# EAGLE design dj midi controller (EAGLE 9.4.0)
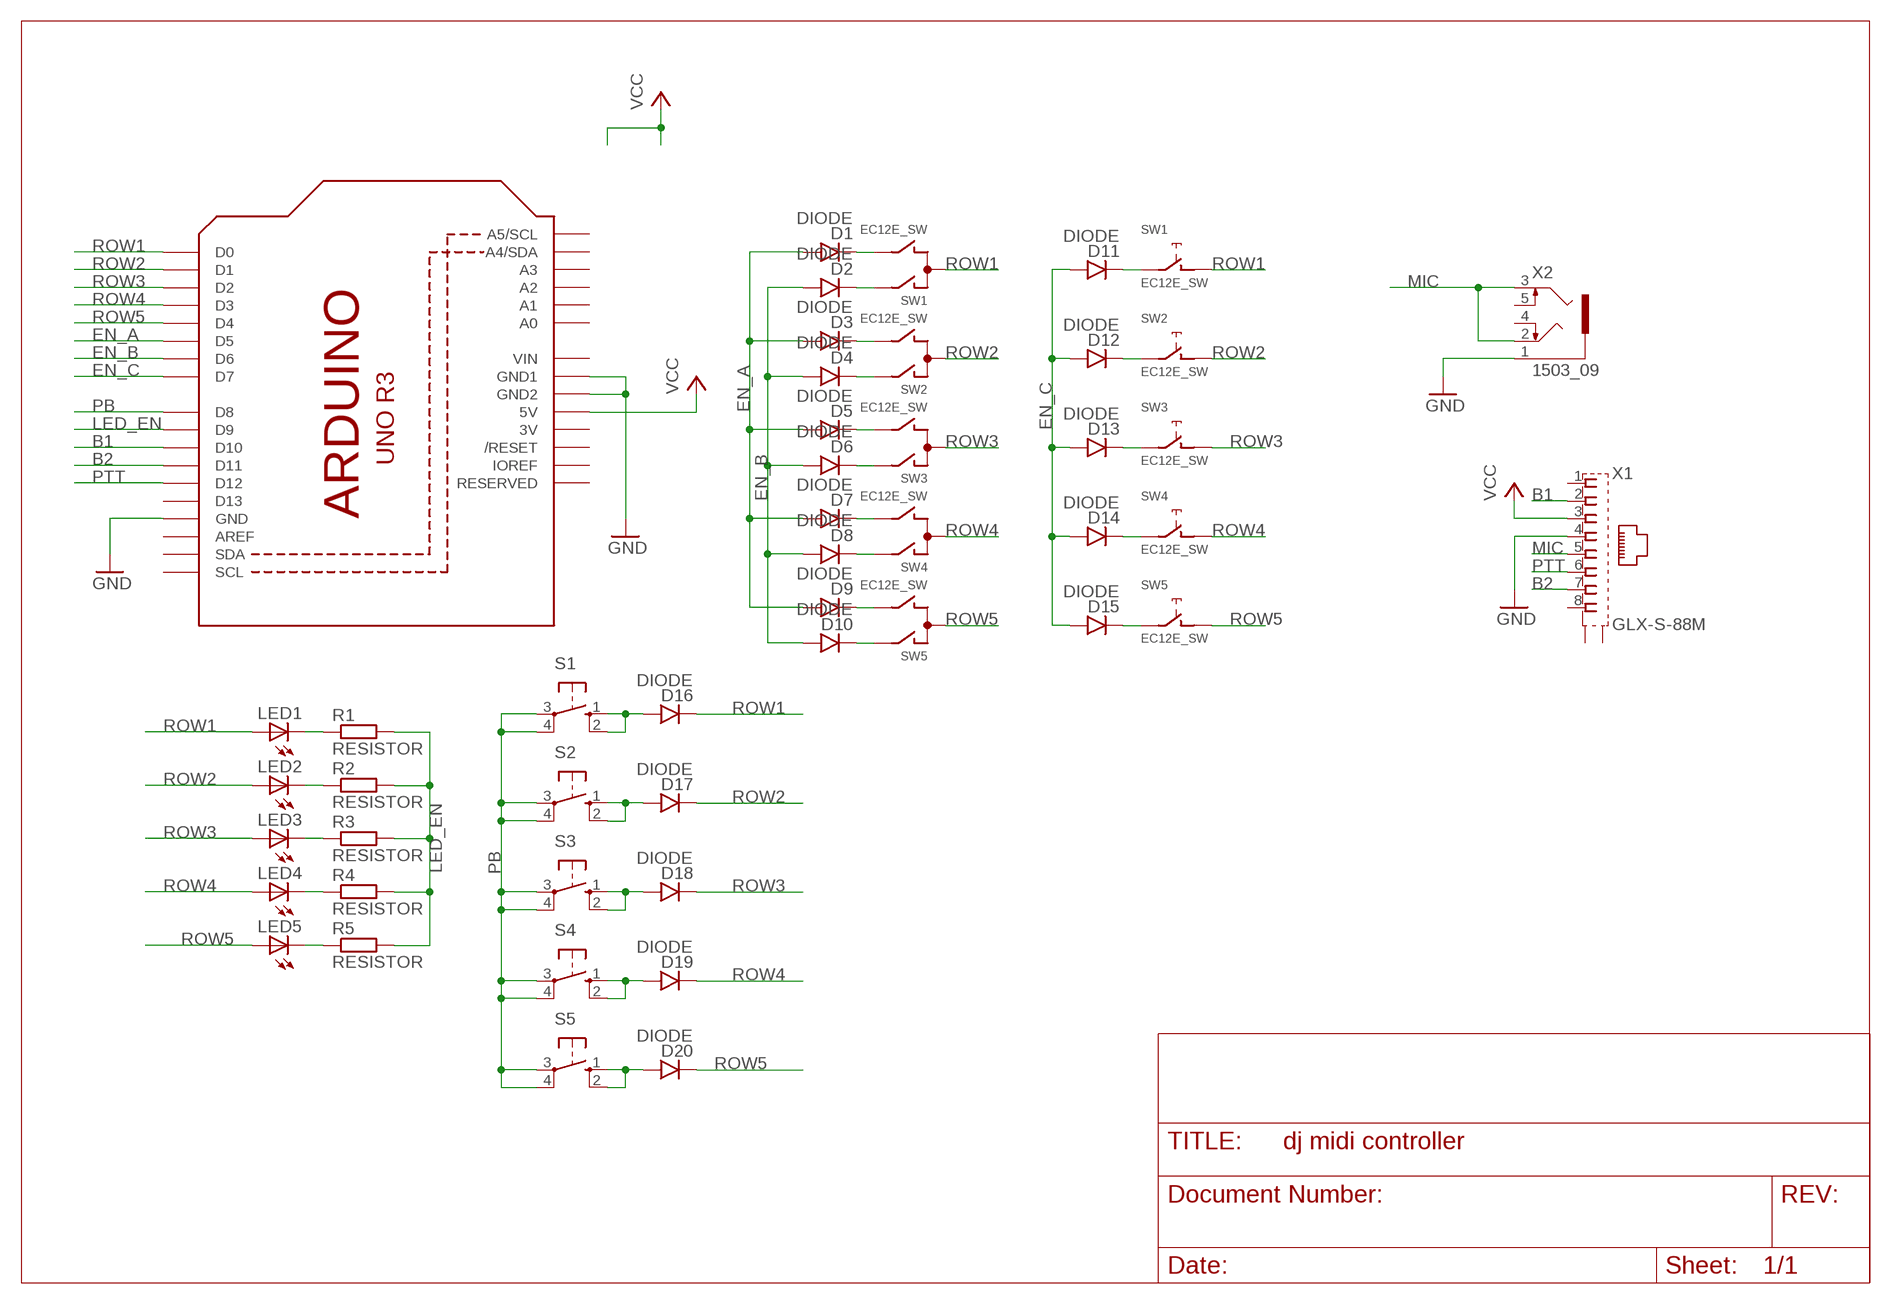
[diagram p0: schematic, sheet 1]

## Parts
D1  DIODE  [M0805]
D2  DIODE  [M0805]
D3  DIODE  [M0805]
D4  DIODE  [M0805]
D5  DIODE  [M0805]
D6  DIODE  [M0805]
D7  DIODE  [M0805]
D8  DIODE  [M0805]
D9  DIODE  [M0805]
D10  DIODE  [M0805]
D11  DIODE  [M0805]
D12  DIODE  [M0805]
D13  DIODE  [M0805]
D14  DIODE  [M0805]
D15  DIODE  [M0805]
D16  DIODE  [M0805]
D17  DIODE  [M0805]
D18  DIODE  [M0805]
D19  DIODE  [M0805]
D20  DIODE  [M0805]
LED1  LED3MM  [LED3MM]
LED2  LED3MM  [LED3MM]
LED3  LED3MM  [LED3MM]
LED4  LED3MM  [LED3MM]
LED5  LED3MM  [LED3MM]
R1  RESISTOR  [M0805]
R2  RESISTOR  [M0805]
R3  RESISTOR  [M0805]
R4  RESISTOR  [M0805]
R5  RESISTOR  [M0805]
S1  10-XX  [B3F-10XX]
S2  10-XX  [B3F-10XX]
S3  10-XX  [B3F-10XX]
S4  10-XX  [B3F-10XX]
S5  10-XX  [B3F-10XX]
SW1  EC12E_SW  [ALPS_EC12E_SW]
SW2  EC12E_SW  [ALPS_EC12E_SW]
SW3  EC12E_SW  [ALPS_EC12E_SW]
SW4  EC12E_SW  [ALPS_EC12E_SW]
SW5  EC12E_SW  [ALPS_EC12E_SW]
U2  ARDUINOR3-DIMENSION  [ARDUINOR3]
X1  GLX-S-88M  [GLX-S-88M]
X2  1503_09  [1503_09]

## Nets
B1: U2.D10 X1.2
B2: U2.D11 X1.7
EN_A: D1.1(A) D3.1(A) D5.1(A) D7.1(A) D9.1(A) U2.D5
EN_B: D2.1(A) D4.1(A) D6.1(A) D8.1(A) D10.1(A) U2.D6
EN_C: D11.1(A) D12.1(A) D13.1(A) D14.1(A) D15.1(A) U2.D7
GND: U2.GND U2.GND1 U2.GND2 X1.4 X2.1
LED_EN: R1.2 R2.2 R3.2 R4.2 R5.2 U2.D9
MIC: X1.5 X2.2 X2.3
N$1: D1.2(C) SW1.B
N$2: D2.2(C) SW1.A
N$3: D3.2(C) SW2.B
N$4: D4.2(C) SW2.A
N$5: D5.2(C) SW3.B
N$6: D6.2(C) SW3.A
N$7: D7.2(C) SW4.B
N$8: D8.2(C) SW4.A
N$9: D9.2(C) SW5.B
N$10: D10.2(C) SW5.A
N$11: D16.1(A) S1.1(S) S1.2(S1)
N$12: D17.1(A) S2.1(S) S2.2(S1)
N$13: D18.1(A) S3.1(S) S3.2(S1)
N$14: D19.1(A) S4.1(S) S4.2(S1)
N$15: D20.1(A) S5.1(S) S5.2(S1)
N$16: D11.2(C) SW1.E
N$17: D12.2(C) SW2.E
N$18: D13.2(C) SW3.E
N$19: D14.2(C) SW4.E
N$20: D15.2(C) SW5.E
N$21: LED1.K(C) R1.1
N$22: LED2.K(C) R2.1
N$23: LED3.K(C) R3.1
N$24: LED4.K(C) R4.1
N$25: LED5.K(C) R5.1
PB: S1.3(P) S1.4(P1) S2.3(P) S2.4(P1) S3.3(P) S3.4(P1) S4.3(P) S4.4(P1) S5.3(P) S5.4(P1) U2.D8
PTT: U2.D12 X1.6
ROW1: D16.2(C) LED1.A SW1.C SW1.D U2.D0
ROW2: D17.2(C) LED2.A SW2.C SW2.D U2.D1
ROW3: D18.2(C) LED3.A SW3.C SW3.D U2.D2
ROW4: D19.2(C) LED4.A SW4.C SW4.D U2.D3
ROW5: D20.2(C) LED5.A SW5.C SW5.D U2.D4
VCC: U2.5V X1.3
Unconnected: SW1.GND1(G) SW1.GND2(G) SW2.GND1(G) SW2.GND2(G) SW3.GND1(G) SW3.GND2(G) SW4.GND1(G) SW4.GND2(G) SW5.GND1(G) SW5.GND2(G) U2.A0 U2.A1 U2.A2 U2.A3 U2.A4(A4/SDA) U2.A5(A5/SCL) U2.AREF U2.D13 U2.IOREF U2.RESERVED U2.RESET(/RESET) U2.SCL U2.SDA X1.1 X1.8 X1.S1 X1.S2 X2.4 X2.5

## Power pins joined to a net without a drawn wire
3V: U2.3V
VIN: U2.VIN

## Library data of the parts
D1-D20 = ido:DIODE
LED1-LED5 = adafruit:LED: LED OSRAM: - CHIPLED LG R971, LG N971, LY N971, LG Q971, LY Q971, LO R971, LY R971 LH N974, LH R974 LS Q976, LO Q976, LY Q976 LO Q996 - Hyper CHIPLED LW Q18S LB Q993, LB Q99A, LB R99A - SideLED LS A670, LO A670, LY A670, LG A670, LP A670 LB A673, LV A673, LT A673, LW A673 LH A674 LY A675 LS A676, LA A676, LO A676, LY A676, LW A676 LS A679, LY A679, LG A679 - Hyper Micro SIDELED® LS Y876, LA Y876, LO Y876, LY Y876 LT Y87S - SmartLED LW L88C, LW L88S LB L89C, LB L89S, LG L890 LS L89K, LO L89K, LY L89K LS L896, LA L896, LO L896, LY L896 - TOPLED LS T670, LO T670, LY T670, LG T670, LP T670 LSG T670, LSP T670, LSY T670, LOP T670, LYG T670 LG T671, LOG T671, LSG T671 LB T673, LV T673, LT T673, LW T673 LH T674 LS T676, LA T676, LO T676, LY T676, LB T676, LH T676, LSB T676, LW T676 LB T67C, LV T67C, LT T67C, LS T67K, LO T67K, LY T67K, LW E67C LS E67B, LA E67B, LO E67B, LY E67B, LB E67C, LV E67C, LT E67C LW T67C LS T679, LY T679, LG T679 LS T770, LO T770, LY T770, LG T770, LP T770 LB T773, LV T773, LT T773, LW T773 LH T774 LS E675, LA E675, LY E675, LS T675 LS T776, LA T776, LO T776, LY T776, LB T776 LHGB T686 LT T68C, LB T68C - Hyper Mini TOPLED® LB M676 - Mini TOPLED Santana® LG M470 LS M47K, LO M47K, LY M47K Source: http://www.osram.convergy.de/
R1-R5 = ido:RESISTOR
S1-S5 = switch-omron:10-XX: OMRON SWITCH; MPN: B3F-1000; OC_FARNELL: 176432; OC_NEWARK: 36M3542
SW1-SW5 = switch-alps:EC12E_SW: ALPS rotary Encoder EC12E series with switch; MPN: EC12E2424407; OC_FARNELL: 1520813; OC_NEWARK: 74M1068
U2 = adafruit:ARDUINOR3: This is a new object for the new Arduino R3 - with extra pins that you may want to use (such as IOref, and duplicated A4/A5
X1 = con-kycon:GLX-S-88M: Mod. Jack, Right Angle, 8 posiotion, 8 contatcs RJ45 Source: GLX-S-88M.pdf; OC_FARNELL: unknown; OC_NEWARK: unknown
X2 = con-lumberg:1503_09: Jack connectors according to JISC 6560, 3.5 mm Klinkeneinbaukupplung nach JISC 6560, 3,5 mm, 3-polig/ stereo, abgewinkelte Ausführung, mit 2 Öffnern und Lötaugen, für Leiterplatten Rückseitenmontage Source: http://www.lumberg.com/Produkte/PDFs/1503_09.pdf; OC_FARNELL: 1243244; OC_NEWARK: unknown

## Board
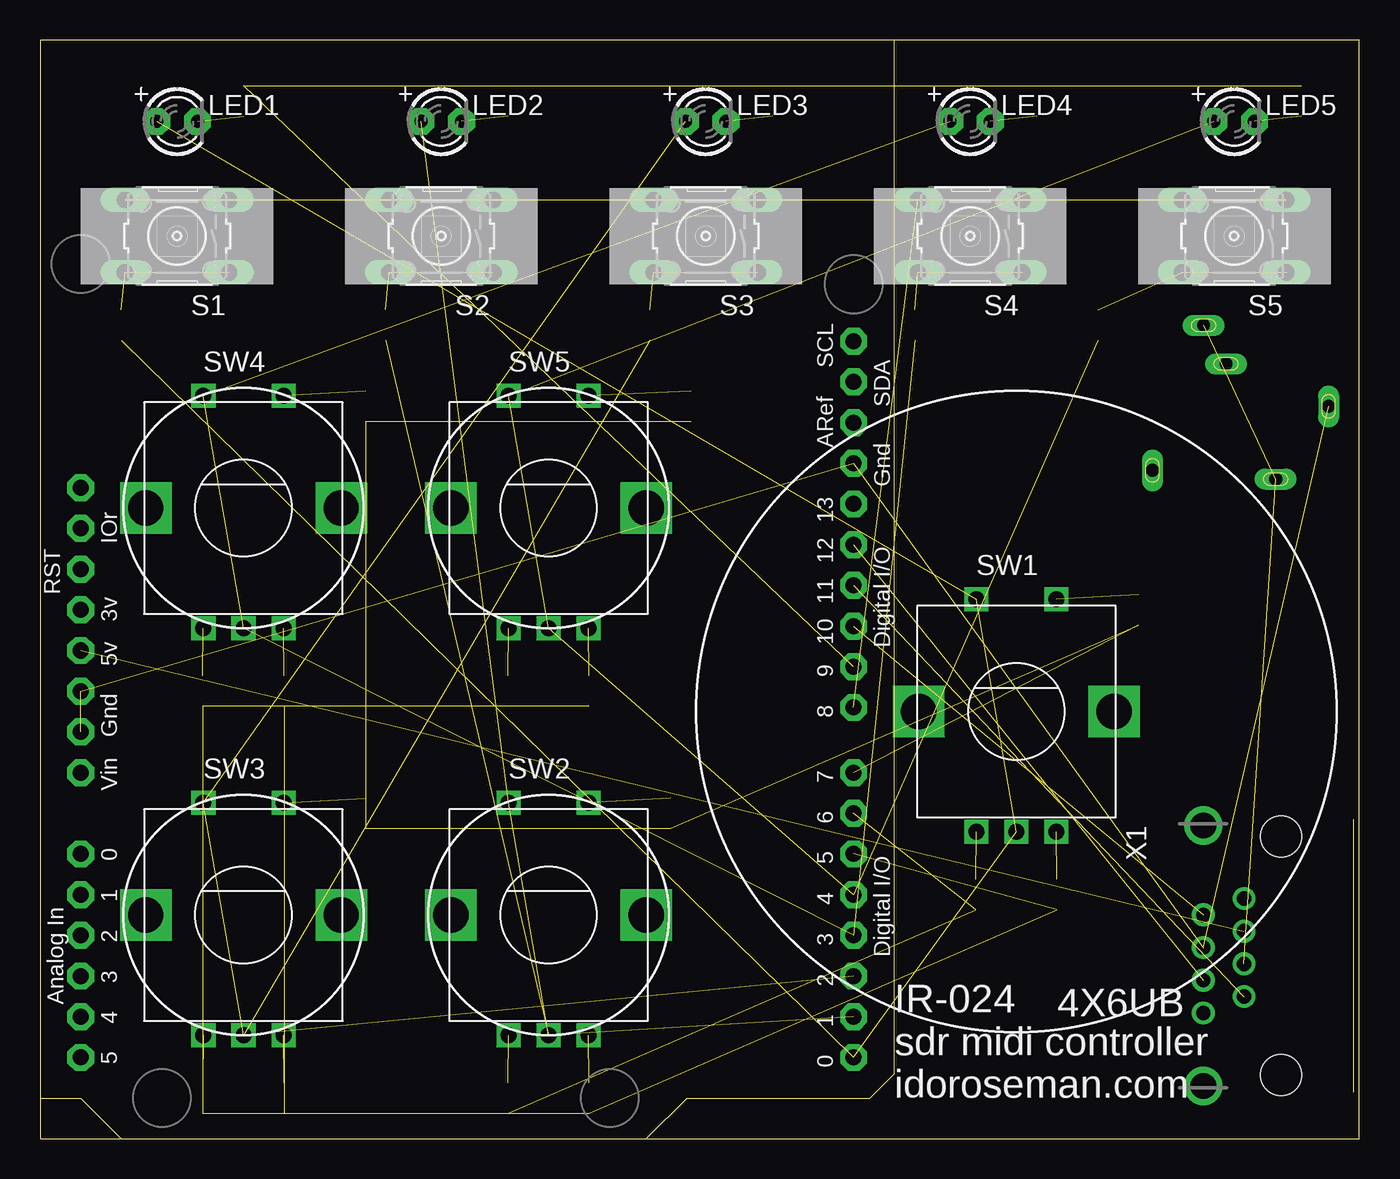
[diagram p1: board, top side]
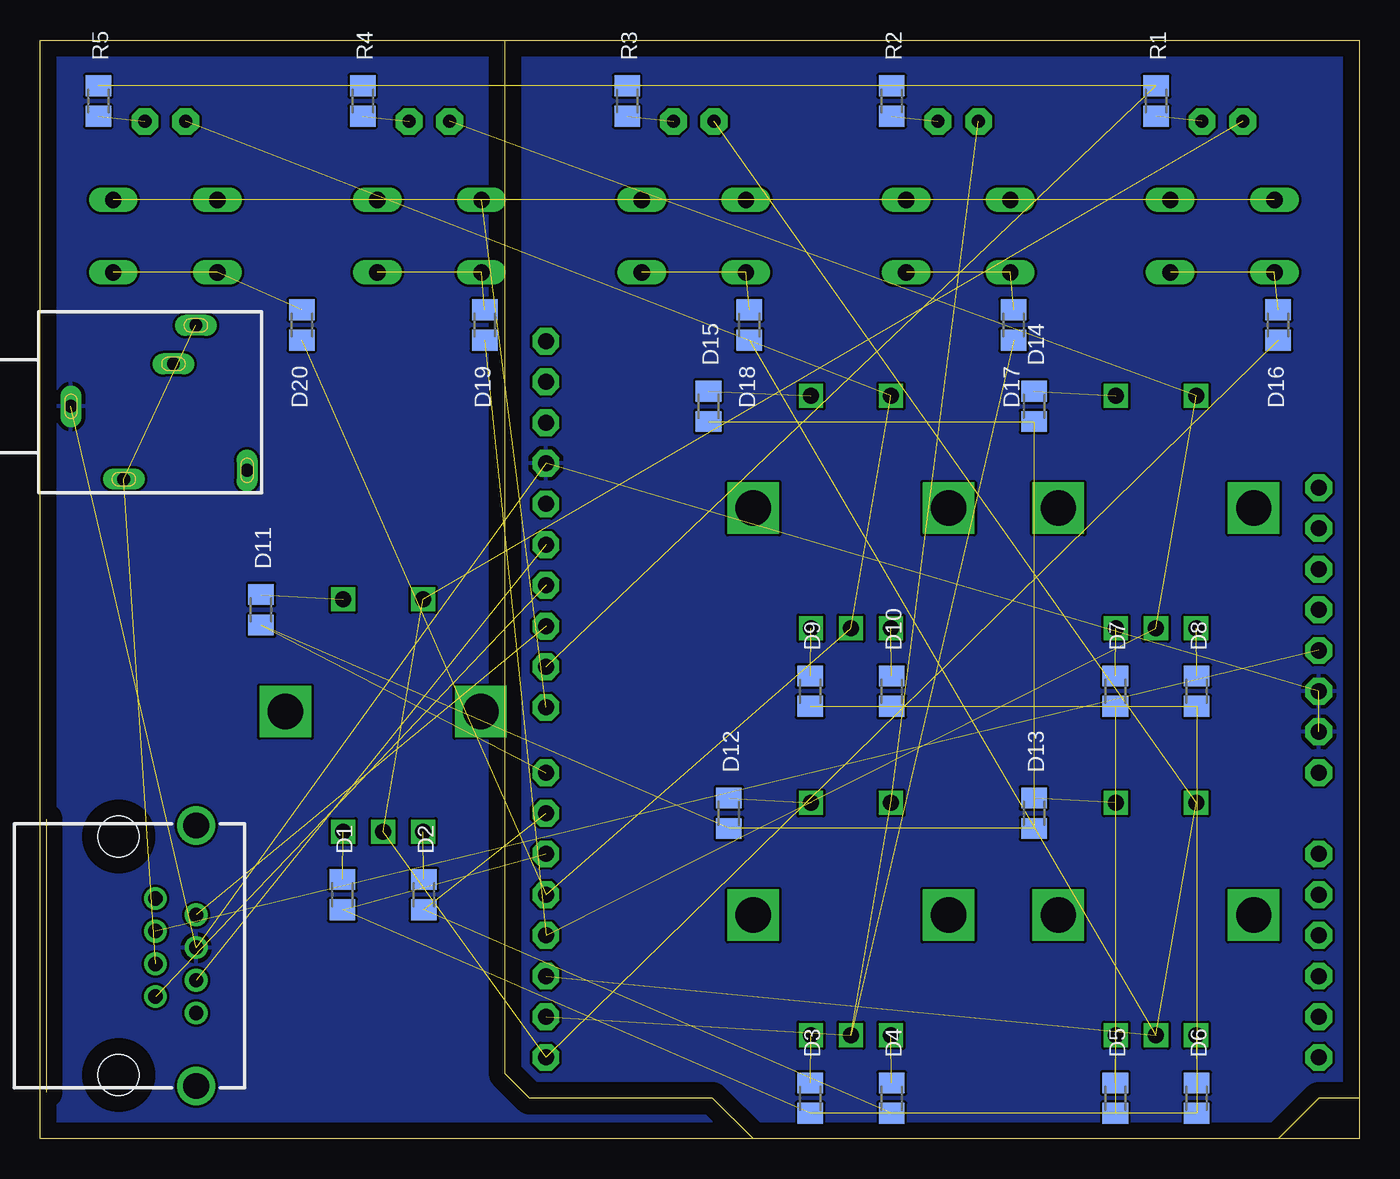
[diagram p2: board, bottom side, seen from below]

Size 82.38 x 68.58 mm. Coordinates in mm from the lower left corner, seen from the top.
Outline: 0,0 82.38,0 82.38,68.57 0,68.57 0,0
Copper layers (1*16): Top 0.035mm / dielectric 1.5mm / Bottom 0.035mm
Design rules "default": minimum track width 6mil, minimum drill 0.35mm, track to track 6mil, track to pad 6mil, pad to pad 6mil, via to via 6mil, smd to smd 6mil, copper to edge 40mil, drill to drill 6mil, minimum pad ring 10mil, minimum via ring 8mil, stop-mask expansion 4mil, vias tented up to drill 0mil, thermal gap 10mil

### Footprints (pad centres in the part's own frame; a part is rotated, then mirrored left to right if it is on the bottom)
M0805 = smd 1.3 x 1.6: 1 -0.95,0; 2 0.95,0
LED3MM = drill 0.813 pad 1.676 octagon: A -1.27,0; K 1.27,0
B3F-10XX = drill 1.016 long: 1 -3.251,2.261; 2 3.251,2.261; 3 -3.251,-2.261; 4 3.251,-2.261
ALPS_EC12E_SW = drill 1 square: A -2.5,-7.5; B 2.5,-7.5; C 0,-7.5; D -2.5,7; E 2.5,7 | drill 2.2 square: GND1 -6.1,0; GND2 6.1,0
ARDUINOR3 = drill 1 pad 1.676 octagon: 3V 35.56,2.54; 5V 38.1,2.54; A0 50.8,2.54; A1 53.34,2.54; A2 55.88,2.54; A3 58.42,2.54; A4 60.96,2.54; A5 63.5,2.54; AREF 23.876,50.8; D0 63.5,50.8; D1 60.96,50.8; D2 58.42,50.8; D3 55.88,50.8; D4 53.34,50.8; D5 50.8,50.8; D6 48.26,50.8; D7 45.72,50.8; D8 41.656,50.8; D9 39.116,50.8; D10 36.576,50.8; D11 34.036,50.8; D12 31.496,50.8; D13 28.956,50.8; GND 26.416,50.8; GND1 43.18,2.54; GND2 40.64,2.54; IOREF 30.48,2.54; RESERVED 27.94,2.54; RESET 33.02,2.54; SCL 18.796,50.8; SDA 21.336,50.8; VIN 45.72,2.54
GLX-S-88M = drill 0.9 pad 1.422: 1 -3.57,-2.3; 2 -2.55,-4.84; 3 -1.53,-2.3; 4 -0.51,-4.84; 5 0.51,-2.3; 6 1.53,-4.84; 7 2.55,-2.3; 8 3.57,-4.84 | drill 1.6 pad 2.184: S1 -8.125,-4.84; S2 8.125,-4.84 | hole 2.55: -7.44,0; 7.44,0
1503_09 = drill 0.8 pad 1.2 long: 1 0,-2.1; 2 -4.55,-5.4; 3 5.05,-9.9; 4 -4,-13.1; 5 2.65,-8.5

### Placement (x,y rotation side)
D1  63.5,15.24 90 bottom
D2  58.42,15.24 90 bottom
D3  34.29,2.54 90 bottom
D4  29.21,2.54 90 bottom
D5  15.24,2.54 90 bottom
D6  10.16,2.54 90 bottom
D7  15.24,27.94 90 bottom
D8  10.16,27.94 90 bottom
D9  34.29,27.94 90 bottom
D10  29.21,27.94 90 bottom
D11  68.58,33.02 90 bottom
D12  39.37,20.32 90 bottom
D13  20.32,20.32 90 bottom
D14  20.32,45.72 90 bottom
D15  40.64,45.72 90 bottom
D16  5.08,50.8 270 bottom
D17  21.59,50.8 270 bottom
D18  38.1,50.8 270 bottom
D19  54.61,50.8 270 bottom
D20  66.04,50.8 270 bottom
LED1  8.56,63.5 0 top
LED2  25.05,63.5 0 top
LED3  41.56,63.5 0 top
LED4  58.07,63.5 0 top
LED5  74.56,63.5 0 top
R1  12.7,64.77 90 bottom
R2  29.21,64.77 90 bottom
R3  45.72,64.77 90 bottom
R4  62.23,64.77 90 bottom
R5  78.74,64.77 90 bottom
S1  8.56,56.34 180 top
S2  25.05,56.34 180 top
S3  41.56,56.34 180 top
S4  58.07,56.34 180 top
S5  74.56,56.34 180 top
SW1  60.96,26.67 0 top
SW2  31.75,13.97 0 top
SW3  12.7,13.97 0 top
SW4  12.7,39.37 0 top
SW5  31.75,39.37 0 top
U2  0,68.58 270 top
X1  77.47,11.43 270 top
X2  82.55,45.72 90 bottom

### Tracks (layer width: path | path; a pad name or v marks a point on that pad's centre or on a via)
B1  (1 unrouted)
B2  (1 unrouted)
EN_A  (5 unrouted)
EN_B  (5 unrouted)
EN_C  (5 unrouted)
GND  (4 unrouted)
  pour Bottom: 0,0 0,68.58 82.38,68.58 82.38,0
LED_EN  (5 unrouted)
MIC  (2 unrouted)
N$1  (1 unrouted)
N$2  (1 unrouted)
N$3  (1 unrouted)
N$4  (1 unrouted)
N$5  (1 unrouted)
N$6  (1 unrouted)
N$7  (1 unrouted)
N$8  (1 unrouted)
N$9  (1 unrouted)
N$10  (1 unrouted)
N$11  (2 unrouted)
N$12  (2 unrouted)
N$13  (2 unrouted)
N$14  (2 unrouted)
N$15  (2 unrouted)
N$16  (1 unrouted)
N$17  (1 unrouted)
N$18  (1 unrouted)
N$19  (1 unrouted)
N$20  (1 unrouted)
N$21  (1 unrouted)
N$22  (1 unrouted)
N$23  (1 unrouted)
N$24  (1 unrouted)
N$25  (1 unrouted)
PB  (10 unrouted)
PTT  (1 unrouted)
ROW1  (4 unrouted)
ROW2  (4 unrouted)
ROW3  (4 unrouted)
ROW4  (4 unrouted)
ROW5  (4 unrouted)
VCC  (1 unrouted)

### Text on the board
tPlace: 4X6UB | IR-024 / sdr midi controller / idoroseman.com